# Altium schematic sheet imu.SchDoc
size Letter
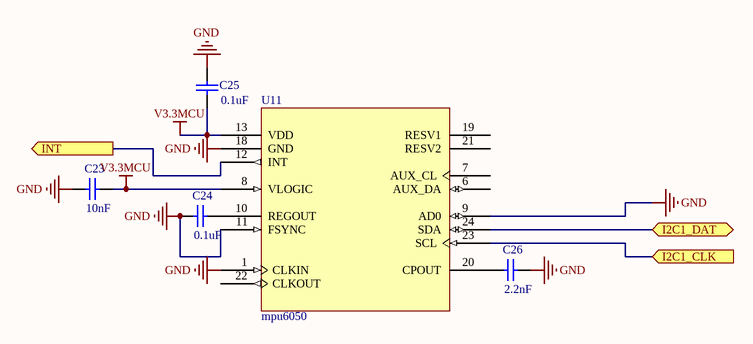
[diagram p0: imu.SchDoc]

## Parts
C23  value 10nF  [1608[0603]]
C24  value 0.1uF  [1608[0603]]
C25  value 0.1uF  [1608[0603]]
C26  value 2.2nF  [1608[0603]]
U11  mpu6050  [QFN-24_N]

## Ports
I2C1_CLK (in), I2C1_DAT (bidir), INT (out)

## Nets
GND: C23.1 C24.1 C25.2 C26.2 U11.1(CLKIN) U11.9(AD0) U11.11(FSYNC) U11.18(GND)
V3.3MCU: C23.2 C25.1 U11.8(VLOGIC) U11.13(VDD)
I2C1_CLK: U11.23(SCL) ; port I2C1_CLK
I2C1_DAT: U11.24(SDA) ; port I2C1_DAT
INT: U11.12(INT) ; port INT
NetC24_2: C24.2 U11.10(REGOUT)
NetC26_1: C26.1 U11.20(CPOUT)

Not connected (* = marked no-connect by the designer): U11 6(AUX_DA) 7(AUX_CL) 19(RESV1) 21(RESV2) 22(CLKOUT)

## Library data of the parts
C23-C26 = Cap Semi: Capacitor (Semiconductor SIM Model); Published: 8-Jun-2000; LatestRevisionDate: 29-May-2009; LatestRevisionNote: IPC-7351 Footprint Added.; PackageReference: C1206; Publisher: Altium Limited; PackageDescription: Chip Capacitor